# EasyEDA schematic Schematic_monitoring.json
TITLE: pcb; REV: 1.0; Date: 2026-05-11; Sheet: 1/1; Drawn By: floating.point.integer; Company: Your Company
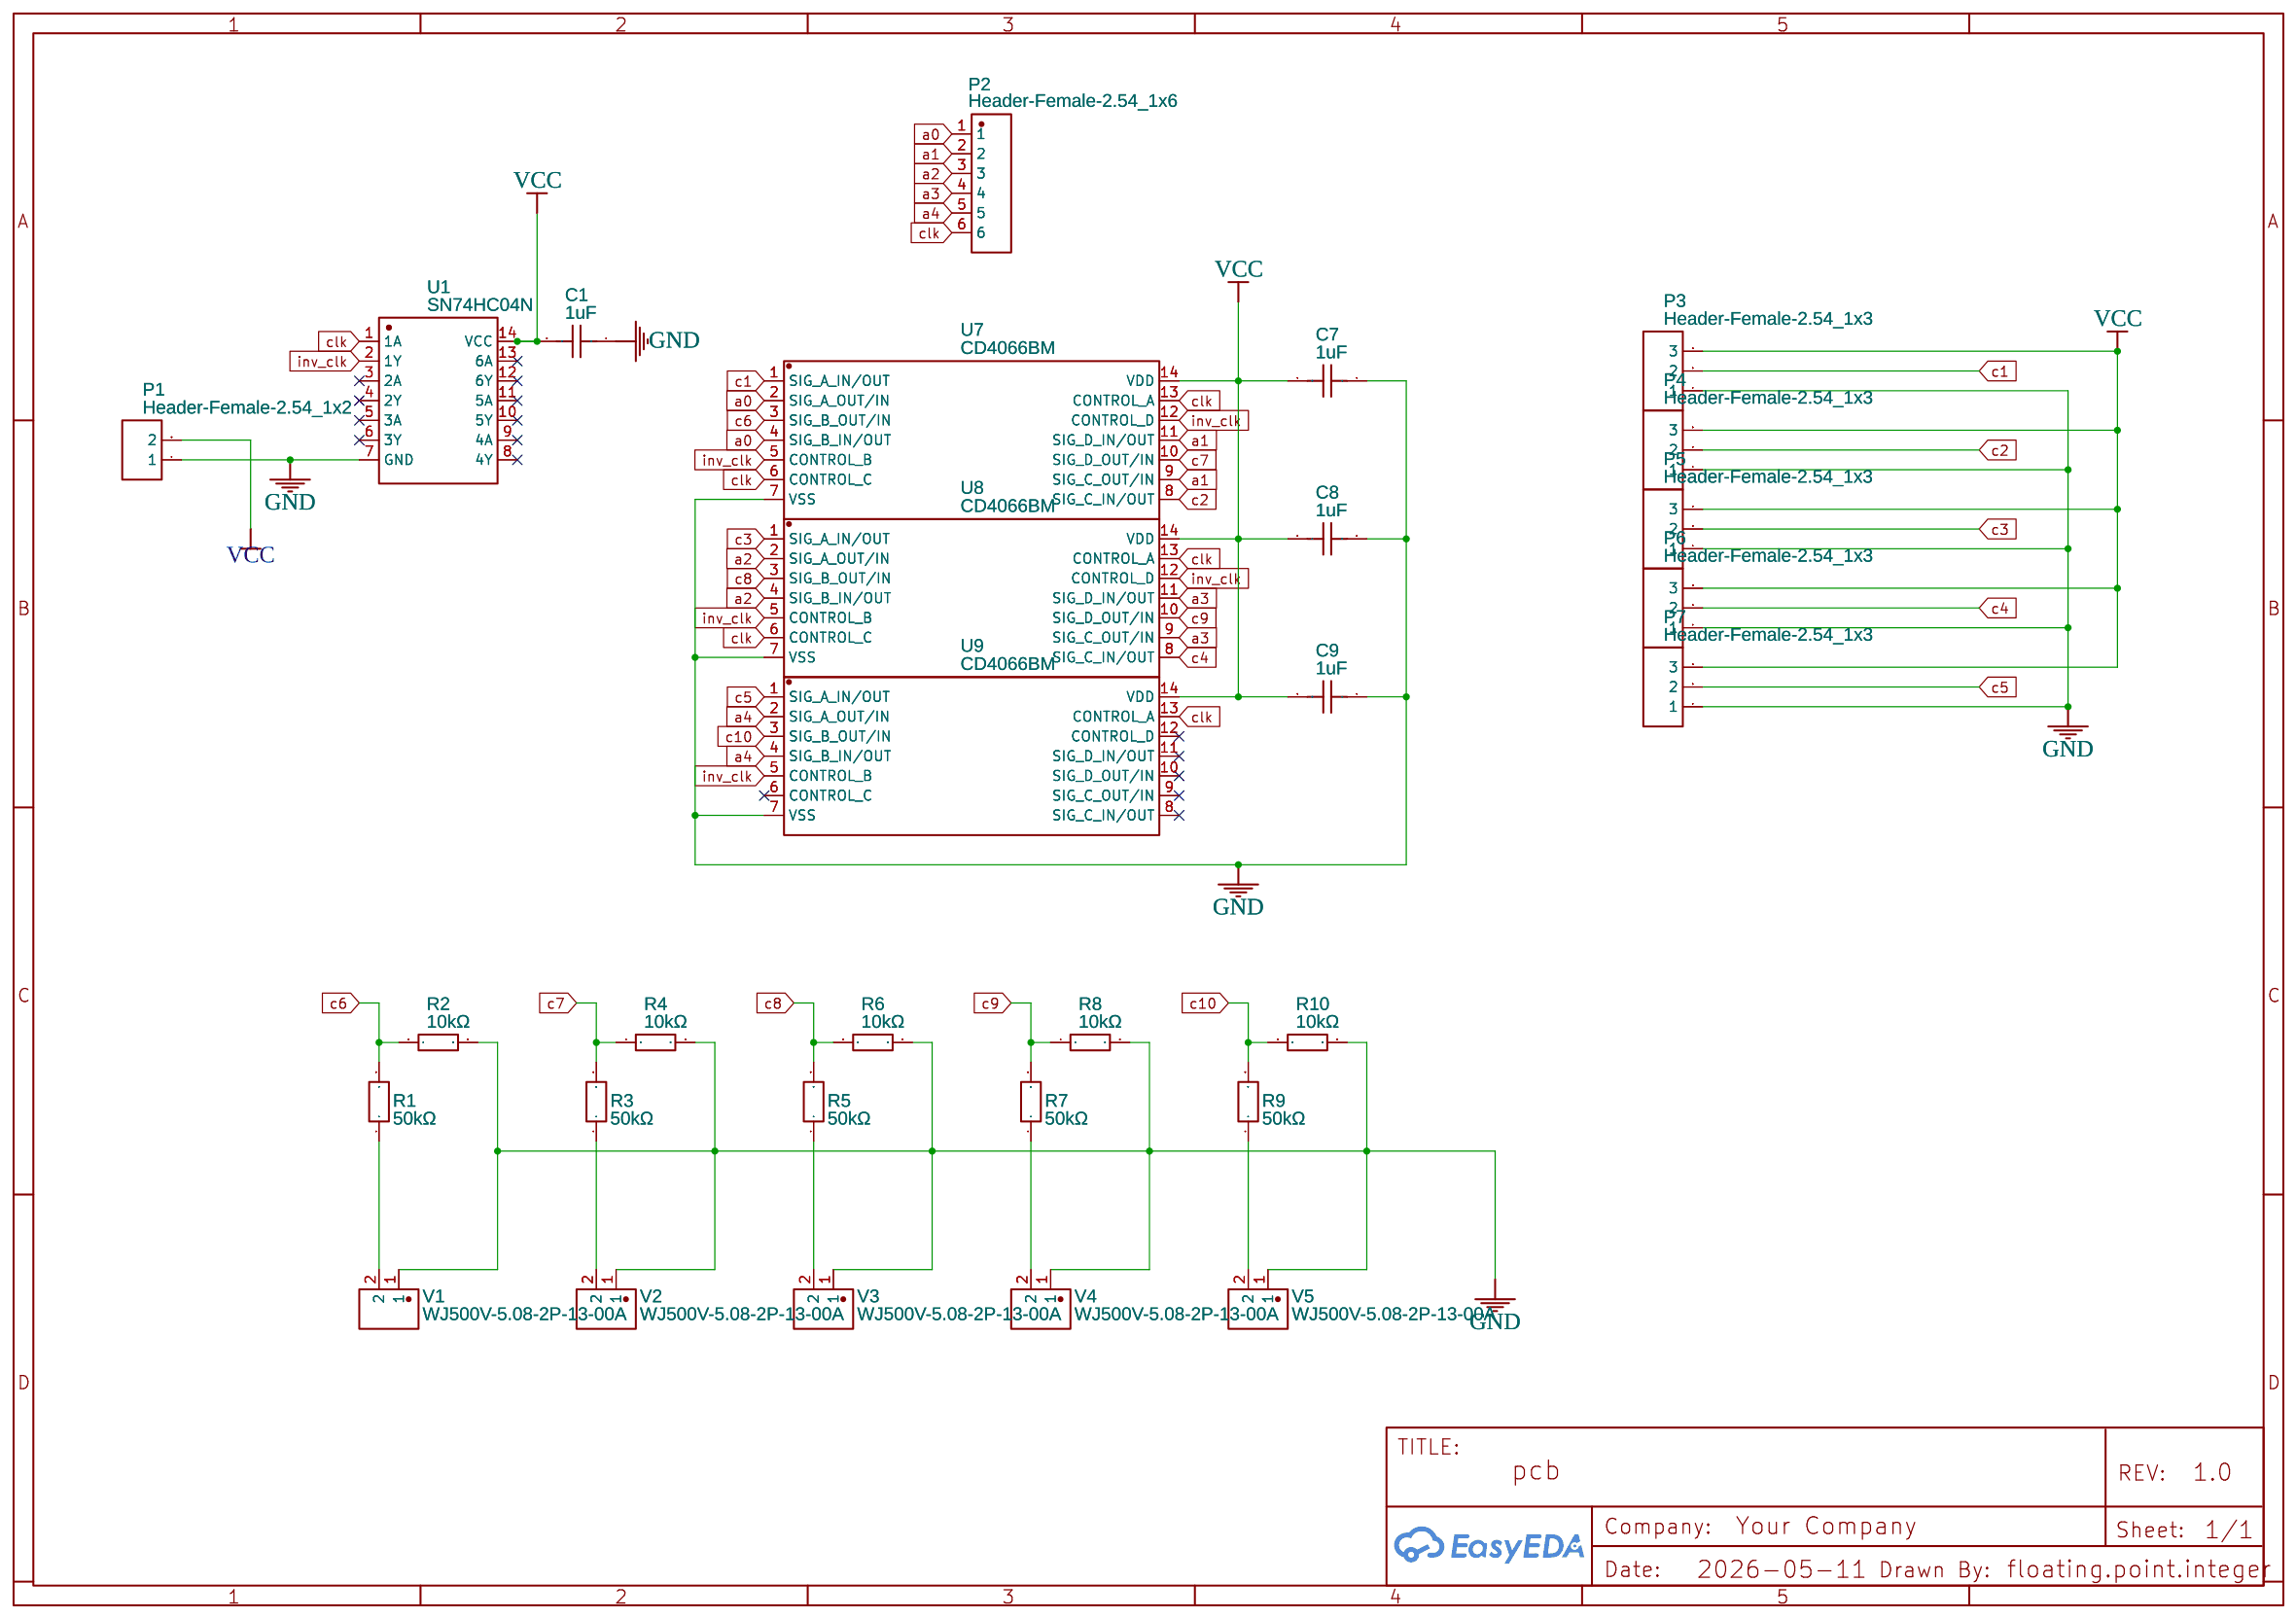
[diagram p0: schematic sheet]

## Parts
C1  1uF  [C0603]
C7  1uF  [C0603]
C8  1uF  [C0603]
C9  1uF  [C0603]
P1  Header-Female-2.54_1x2  [HDR-TH_2P-P2.54-V-F]
P2  Header-Female-2.54_1x6  [HDR-TH_6P-P2.54-V-F]
P3  Header-Female-2.54_1x3  [HDR-TH_3P-P2.54-V-F]
P4  Header-Female-2.54_1x3  [HDR-TH_3P-P2.54-V-F]
P5  Header-Female-2.54_1x3  [HDR-TH_3P-P2.54-V-F]
P6  Header-Female-2.54_1x3  [HDR-TH_3P-P2.54-V-F]
P7  Header-Female-2.54_1x3  [HDR-TH_3P-P2.54-V-F]
R1  50kΩ  [R0603]
R2  10kΩ  [R0603]
R3  50kΩ  [R0603]
R4  10kΩ  [R0603]
R5  50kΩ  [R0603]
R6  10kΩ  [R0603]
R7  50kΩ  [R0603]
R8  10kΩ  [R0603]
R9  50kΩ  [R0603]
R10  10kΩ  [R0603]
U1  SN74HC04N  [DIP-14_L19.2-W6.6-P2.54-LS10.9-BL]
U7  CD4066BM  [SOIC-14_L8.7-W3.9-P1.27-LS6.0-BL]
U8  CD4066BM  [SOIC-14_L8.7-W3.9-P1.27-LS6.0-BL]
U9  CD4066BM  [SOIC-14_L8.7-W3.9-P1.27-LS6.0-BL]
V1  WJ500V-5.08-2P-13-00A  [CONN-TH_2P-P5.08-WJ500V-5.08-2P]
V2  WJ500V-5.08-2P-13-00A  [CONN-TH_2P-P5.08-WJ500V-5.08-2P]
V3  WJ500V-5.08-2P-13-00A  [CONN-TH_2P-P5.08-WJ500V-5.08-2P]
V4  WJ500V-5.08-2P-13-00A  [CONN-TH_2P-P5.08-WJ500V-5.08-2P]
V5  WJ500V-5.08-2P-13-00A  [CONN-TH_2P-P5.08-WJ500V-5.08-2P]

## Library data of the parts
C1 C7-C9 = 0603B105K250CT: Contributor: LCSC; Supplier: LCSC; Supplier Part: C388002; Manufacturer: Walsin(华新科); JLCPCB Part Class: Extended Part
P1 = Header-Female-2.54_1x2: Supplier: LCSC; Manufacturer: BOOMELE(博穆精密); Manufacturer Part: 2.54-1*2P母; Supplier Part: C49661; JLCPCB Part Class: Extended Part
P2 = Header-Female-2.54_1x6: Supplier: LCSC; Manufacturer: BOOMELE(博穆精密); Manufacturer Part: 2.54-1*6P母; Supplier Part: C40877; JLCPCB Part Class: Extended Part
P3-P7 = Header-Female-2.54_1x3: Supplier Part: C146243; Supplier: LCSC; Manufacturer: BOOMELE(博穆精密); Manufacturer Part: 2.54-1*3P母; JLCPCB Part Class: Extended Part
R1 R3 R5 R7 R9 = RT0603BRD0750KL: Supplier: LCSC; Supplier Part: C861451; Manufacturer: YAGEO(国巨); JLCPCB Part Class: Extended Part; Contributor: lcsc
R2 R4 R6 R8 R10 = RT0603DRD0710KL: Contributor: LCSC; Supplier: LCSC; Manufacturer: YAGEO(国巨); Supplier Part: C136944; JLCPCB Part Class: Extended Part
U1 = SN74HC04N: Supplier: LCSC; Manufacturer: TI(德州仪器); Supplier Part: C2886; JLCPCB Part Class: Extended Part
U7-U9 = CD4066BM: Contributor: LCSC; Supplier: LCSC; Supplier Part: C353979; Manufacturer: TI(德州仪器); JLCPCB Part Class: Extended Part
V1-V5 = WJ500V-5.08-2P-13-00A: Supplier: LCSC; Supplier Part: C42377752; Manufacturer: KANGNEX(康奈克斯电气); Manufacturer Part: WJ500V-5.08-02P-13-00A; JLCPCB Part Class: Extended Part; Contributor: lcsc

## Nets
GND: C1.1 C7.1 C8.1 C9.1 P1.1 P3.1 P4.1 P5.1 P6.1 P7.1 R2.2 R4.2 R6.2 R8.2 R10.2 U1.7(GND) U7.7(VSS) U8.7(VSS) U9.7(VSS) V1.1 V2.1 V3.1 V4.1 V5.1
VCC: C1.2 C7.2 C8.2 C9.2 P1.2 P3.3 P4.3 P5.3 P6.3 P7.3 U1.14(VCC) U7.14(VDD) U8.14(VDD) U9.14(VDD)
a0: P2.1 U7.2(SIG_A_OUT/IN) U7.4(SIG_B_IN/OUT)
a1: P2.2 U7.9(SIG_C_OUT/IN) U7.11(SIG_D_IN/OUT)
a2: P2.3 U8.2(SIG_A_OUT/IN) U8.4(SIG_B_IN/OUT)
a3: P2.4 U8.9(SIG_C_OUT/IN) U8.11(SIG_D_IN/OUT)
a4: P2.5 U9.2(SIG_A_OUT/IN) U9.4(SIG_B_IN/OUT)
c1: P3.2 U7.1(SIG_A_IN/OUT)
c2: P4.2 U7.8(SIG_C_IN/OUT)
c3: P5.2 U8.1(SIG_A_IN/OUT)
c4: P6.2 U8.8(SIG_C_IN/OUT)
c5: P7.2 U9.1(SIG_A_IN/OUT)
c6: R1.2 R2.1 U7.3(SIG_B_OUT/IN)
c7: R3.2 R4.1 U7.10(SIG_D_OUT/IN)
c8: R5.2 R6.1 U8.3(SIG_B_OUT/IN)
c9: R7.2 R8.1 U8.10(SIG_D_OUT/IN)
c10: R9.2 R10.1 U9.3(SIG_B_OUT/IN)
clk: P2.6 U1.1(1A) U7.6(CONTROL_C) U7.13(CONTROL_A) U8.6(CONTROL_C) U8.13(CONTROL_A) U9.13(CONTROL_A)
inv_clk: U1.2(1Y) U7.5(CONTROL_B) U7.12(CONTROL_D) U8.5(CONTROL_B) U8.12(CONTROL_D) U9.5(CONTROL_B)
Net-(R1-1): R1.1 V1.2
Net-(R3-1): R3.1 V2.2
Net-(R5-1): R5.1 V3.2
Net-(R7-1): R7.1 V4.2
Net-(R9-1): R9.1 V5.2

Not connected (* = marked no-connect by the designer): U1 3(2A)* 4(2Y)* 5(3A)* 6(3Y)* 8(4Y)* 9(4A)* 10(5Y)* 11(5A)* 12(6Y)* 13(6A)*; U9 6(CONTROL_C)* 8(SIG_C_IN/OUT)* 9(SIG_C_OUT/IN)* 10(SIG_D_OUT/IN)* 11(SIG_D_IN/OUT)* 12(CONTROL_D)*
